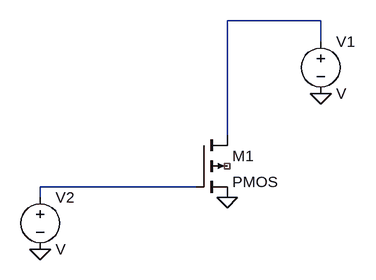
[diagram p0: schematic Draft1.asc]
Draft1.asc, the LTspice schematic file:
Version 4
SHEET 1 880 680
WIRE 352 -64 208 -64
WIRE 352 -32 352 -64
WIRE 208 112 208 -64
WIRE 160 192 -80 192
WIRE -80 208 -80 192
FLAG 352 48 0
FLAG 208 208 0
FLAG -80 288 0
SYMBOL pmos4 160 112 R0
SYMATTR InstName M1
SYMBOL voltage 352 -48 R0
SYMATTR InstName V1
SYMBOL voltage -80 192 R0
SYMATTR InstName V2

The netlist it stands for:
* Draft1.asc
M1 N001 N002 0 NC_01 PMOS
V1 N001 0 V
V2 N002 0 V
.model NMOS NMOS
.model PMOS PMOS
.lib standard.mos
.backanno
.end